# Altium schematic sheet CORE.SchDoc
size A4; SheetNumber: 1; SheetTotal: 6
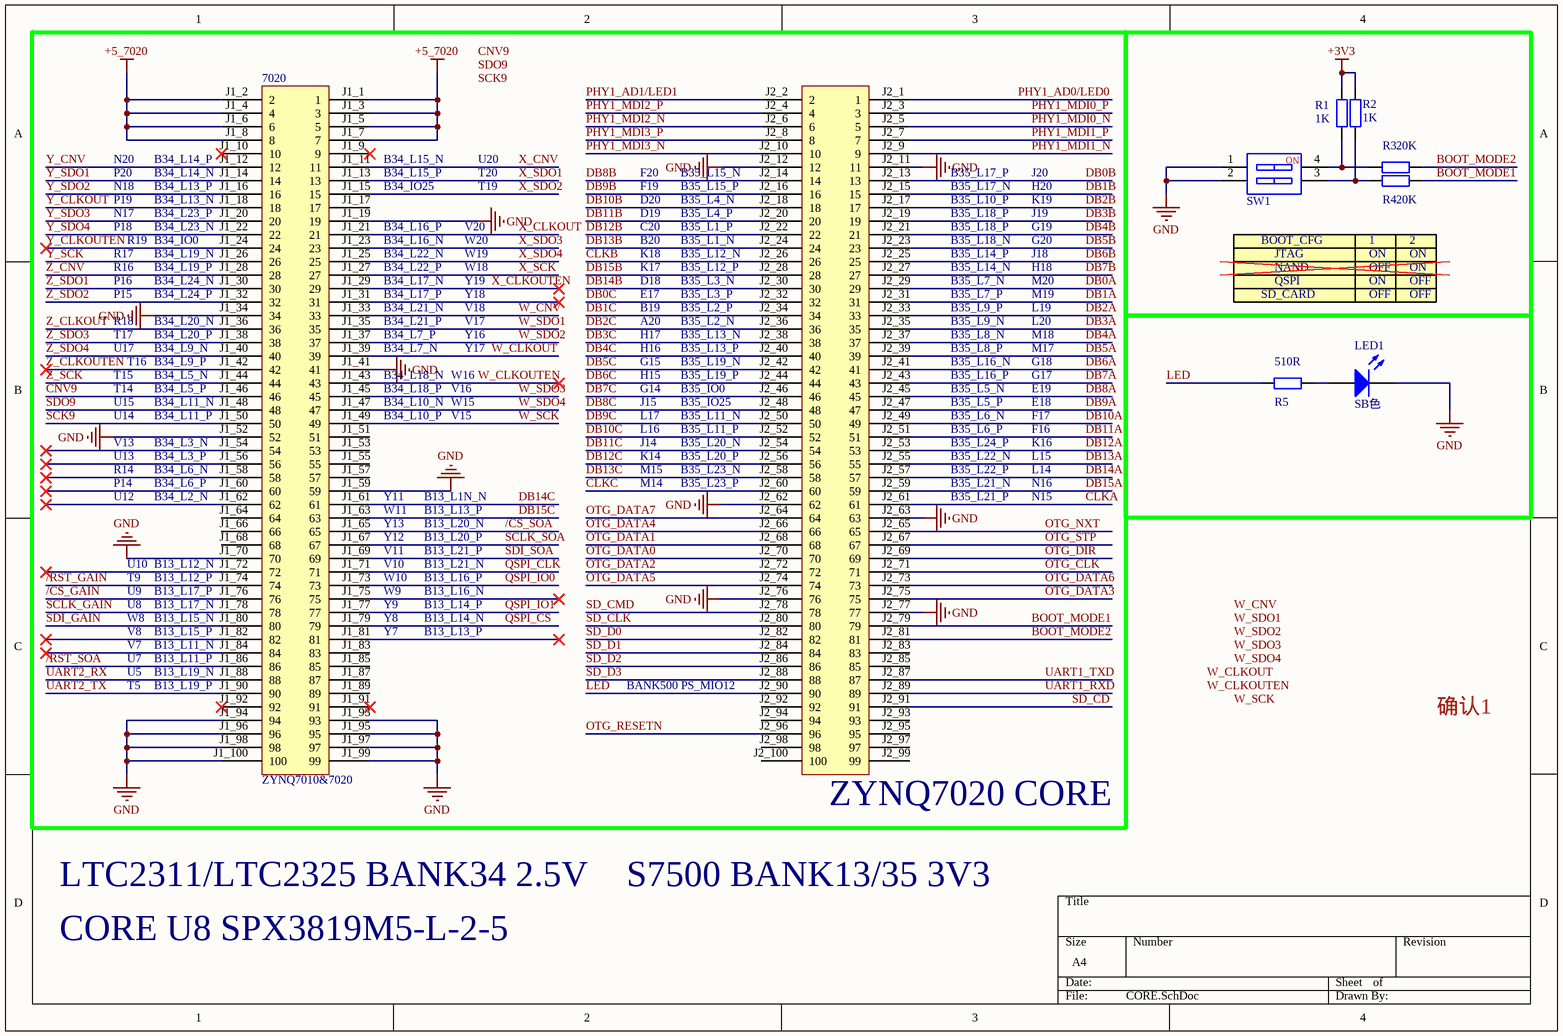
[diagram p0: CORE.SchDoc]

## Parts
7020  ZYNQ7010&7020  [ZYNQ7010&7020_CB]
LED1  SB色  [LED0603_B]
R1  1K  [R0402_L]
R2  1K  [R0402_L]
R3  20K  [R0402_L]
R4  20K  [R0402_L]
R5  510R  [R0603_L]
SW1  DIP-SW-2P  [SW DIP-2P]  (value not drawn)

## Blocks framed on the sheet
ZYNQ7020 CORE: 7020

## Nets
+3V3: R1.2 R2.2
+5_7020: 7020.J1_1(1) 7020.J1_2(2) 7020.J1_3(3) 7020.J1_4(4) 7020.J1_5(5) 7020.J1_6(6) 7020.J1_7(7) 7020.J1_8(8)
GND: 7020.J1_19(19) 7020.J1_34(34) 7020.J1_41(41) 7020.J1_52(52) 7020.J1_59(59) 7020.J1_70(70) 7020.J1_93(93) 7020.J1_94(94) 7020.J1_95(95) 7020.J1_96(96) 7020.J1_97(97) 7020.J1_98(98) 7020.J1_99(99) 7020.J1_100(100) 7020.J2_11(11) 7020.J2_12(12) 7020.J2_62(62) 7020.J2_63(63) 7020.J2_76(76) 7020.J2_77(77) LED1.2(K) SW1.1 SW1.2
/CS_GAIN: 7020.J1_76(76)
/CS_SOA: 7020.J1_65(65)
/RST_GAIN: 7020.J1_74(74)
/RST_SOA: 7020.J1_86(86)
BOOT_MODE1: 7020.J2_79(79) R4.2
BOOT_MODE2: 7020.J2_81(81) R3.2
CLKA: 7020.J2_61(61)
CLKB: 7020.J2_26(26)
CLKC: 7020.J2_60(60)
CNV9: 7020.J1_46(46)
DB0A: 7020.J2_29(29)
DB0B: 7020.J2_13(13)
DB0C: 7020.J2_32(32)
DB1A: 7020.J2_31(31)
DB1B: 7020.J2_15(15)
DB1C: 7020.J2_34(34)
DB2A: 7020.J2_33(33)
DB2B: 7020.J2_17(17)
DB2C: 7020.J2_36(36)
DB3A: 7020.J2_35(35)
DB3B: 7020.J2_19(19)
DB3C: 7020.J2_38(38)
DB4A: 7020.J2_37(37)
DB4B: 7020.J2_21(21)
DB4C: 7020.J2_40(40)
DB5A: 7020.J2_39(39)
DB5B: 7020.J2_23(23)
DB5C: 7020.J2_42(42)
DB6A: 7020.J2_41(41)
DB6B: 7020.J2_25(25)
DB6C: 7020.J2_44(44)
DB7A: 7020.J2_43(43)
DB7B: 7020.J2_27(27)
DB7C: 7020.J2_46(46)
DB8A: 7020.J2_45(45)
DB8B: 7020.J2_14(14)
DB8C: 7020.J2_48(48)
DB9A: 7020.J2_47(47)
DB9B: 7020.J2_16(16)
DB9C: 7020.J2_50(50)
DB10A: 7020.J2_49(49)
DB10B: 7020.J2_18(18)
DB10C: 7020.J2_52(52)
DB11A: 7020.J2_51(51)
DB11B: 7020.J2_20(20)
DB11C: 7020.J2_54(54)
DB12A: 7020.J2_53(53)
DB12B: 7020.J2_22(22)
DB12C: 7020.J2_56(56)
DB13A: 7020.J2_55(55)
DB13B: 7020.J2_24(24)
DB13C: 7020.J2_58(58)
DB14A: 7020.J2_57(57)
DB14B: 7020.J2_30(30)
DB14C: 7020.J1_61(61)
DB15A: 7020.J2_59(59)
DB15B: 7020.J2_28(28)
DB15C: 7020.J1_63(63)
LED: 7020.J2_90(90) R5.1
OTG_CLK: 7020.J2_71(71)
OTG_DATA0: 7020.J2_70(70)
OTG_DATA1: 7020.J2_68(68)
OTG_DATA2: 7020.J2_72(72)
OTG_DATA3: 7020.J2_75(75)
OTG_DATA4: 7020.J2_66(66)
OTG_DATA5: 7020.J2_74(74)
OTG_DATA6: 7020.J2_73(73)
OTG_DATA7: 7020.J2_64(64)
OTG_DIR: 7020.J2_69(69)
OTG_NXT: 7020.J2_65(65)
OTG_RESETN: 7020.J2_96(96)
OTG_STP: 7020.J2_67(67)
PHY1_AD0/LED0: 7020.J2_1(1)
PHY1_AD1/LED1: 7020.J2_2(2)
PHY1_MDI0_N: 7020.J2_5(5)
PHY1_MDI0_P: 7020.J2_3(3)
PHY1_MDI1_N: 7020.J2_9(9)
PHY1_MDI1_P: 7020.J2_7(7)
PHY1_MDI2_N: 7020.J2_6(6)
PHY1_MDI2_P: 7020.J2_4(4)
PHY1_MDI3_N: 7020.J2_10(10)
PHY1_MDI3_P: 7020.J2_8(8)
QSPI_CLK: 7020.J1_71(71)
QSPI_CS: 7020.J1_79(79)
QSPI_IO0: 7020.J1_73(73)
QSPI_IO1: 7020.J1_77(77)
SCK9: 7020.J1_50(50)
SCLK_GAIN: 7020.J1_78(78)
SCLK_SOA: 7020.J1_67(67)
SD_CD: 7020.J2_91(91)
SD_CLK: 7020.J2_80(80)
SD_CMD: 7020.J2_78(78)
SD_D0: 7020.J2_82(82)
SD_D1: 7020.J2_84(84)
SD_D2: 7020.J2_86(86)
SD_D3: 7020.J2_88(88)
SDI_GAIN: 7020.J1_80(80)
SDI_SOA: 7020.J1_69(69)
SDO9: 7020.J1_48(48)
UART1_RXD: 7020.J2_89(89)
UART1_TXD: 7020.J2_87(87)
UART2_RX: 7020.J1_88(88)
UART2_TX: 7020.J1_90(90)
W_CLKOUT: 7020.J1_39(39)
W_CLKOUTEN: 7020.J1_43(43)
W_CNV: 7020.J1_33(33)
W_SCK: 7020.J1_49(49)
W_SDO1: 7020.J1_35(35)
W_SDO2: 7020.J1_37(37)
W_SDO3: 7020.J1_45(45)
W_SDO4: 7020.J1_47(47)
X_CLKOUT: 7020.J1_21(21)
X_CLKOUTEN: 7020.J1_29(29)
X_CNV: 7020.J1_11(11)
X_SCK: 7020.J1_27(27)
X_SDO1: 7020.J1_13(13)
X_SDO2: 7020.J1_15(15)
X_SDO3: 7020.J1_23(23)
X_SDO4: 7020.J1_25(25)
Y_CLKOUT: 7020.J1_18(18)
Y_CLKOUTEN: 7020.J1_24(24)
Y_CNV: 7020.J1_12(12)
Y_SCK: 7020.J1_26(26)
Y_SDO1: 7020.J1_14(14)
Y_SDO2: 7020.J1_16(16)
Y_SDO3: 7020.J1_20(20)
Y_SDO4: 7020.J1_22(22)
Z_CLKOUT: 7020.J1_36(36)
Z_CLKOUTEN: 7020.J1_42(42)
Z_CNV: 7020.J1_28(28)
Z_SCK: 7020.J1_44(44)
Z_SDO1: 7020.J1_30(30)
Z_SDO2: 7020.J1_32(32)
Z_SDO3: 7020.J1_38(38)
Z_SDO4: 7020.J1_40(40)
NetLED1_1: LED1.1(A) R5.2
NetR1_1: R1.1 R3.1 SW1.4
NetR2_1: R2.1 R4.1 SW1.3

Not connected (* = marked no-connect by the designer): 7020 J1_9(9)* J1_10(10)* J1_17(17) J1_31(31)* J1_51(51) J1_53(53) J1_54(54)* J1_55(55) J1_56(56)* J1_57(57) J1_58(58)* J1_60(60)* J1_62(62)* J1_64(64) J1_66(66) J1_68(68) J1_72(72)* J1_75(75)* J1_81(81)* J1_82(82)* J1_83(83) J1_84(84)* J1_85(85) J1_87(87) J1_89(89) J1_91(91)* J1_92(92)* J2_83(83) J2_85(85) J2_92(92) J2_93(93) J2_94(94) J2_95(95) J2_97(97) J2_98(98) J2_99(99) J2_100(100)

## Notes on the sheet
- N20
- P20
- (near 7020) B34_L14_P
- (near 7020) B34_L14_N
- (near 7020) B34_L15_N
- (near 7020) B34_L15_P
- (near 7020) U20
- (near 7020) T20
- (near 7020) F20
- (near 7020) B35_L15_N
- B35_L17_P
- J20
- N18
- P19
- N17
- P18
- R19
- (near 7020) B34_L13_P
- (near 7020) B34_L13_N
- (near 7020) B34_L23_P
- B34_IO0
- (near 7020) B34_L23_N
- (near 7020) B34_IO25
- (near 7020) B34_L16_P
- (near 7020) B34_L16_N
- (near 7020) V20
- (near 7020) W20
- (near 7020) T19
- (near 7020) F19
- (near 7020) D20
- (near 7020) D19
- (near 7020) C20
- (near 7020) B20
- (near 7020) B35_L15_P
- (near 7020) B35_L4_N
- (near 7020) B35_L4_P
- (near 7020) B35_L1_P
- (near 7020) B35_L1_N
- B35_L17_N
- B35_L10_P
- B35_L18_P
- B35_L18_N
- H20
- K19
- J19
- G19
- G20
- BOOT_CFG
- 1
- 2
- R17
- R16
- P16
- P15
- (near 7020) B34_L19_N
- (near 7020) B34_L19_P
- (near 7020) B34_L24_N
- (near 7020) B34_L24_P
- (near 7020) B34_L22_N
- (near 7020) B34_L22_P
- (near 7020) B34_L17_N
- (near 7020) B34_L17_P
- (near 7020) B34_L21_N
- (near 7020) W19
- (near 7020) W18
- (near 7020) Y19
- (near 7020) Y18
- (near 7020) V18
- (near 7020) K18
- (near 7020) K17
- (near 7020) D18
- (near 7020) E17
- (near 7020) B19
- (near 7020) B35_L12_N
- (near 7020) B35_L12_P
- (near 7020) B35_L3_N
- (near 7020) B35_L3_P
- (near 7020) B35_L2_P
- B35_L7_N
- B35_L7_P
- B35_L9_P
- B35_L14_P
- B35_L14_N
- M20
- M19
- L19
- J18
- H18
- SD_CARD
- JTAG
- NAND
- QSPI
- ON
- OFF
- R18
- T17
- U17
- T15
- T16
- (near 7020) B34_L20_N
- (near 7020) B34_L20_P
- B34_L9_N
- B34_L9_P
- B34_L5_N
- (near 7020) B34_L21_P
- (near 7020) B34_L7_P
- (near 7020) B34_L7_N
- (near 7020) B34_L18_N
- (near 7020) W16
- (near 7020) V17
- (near 7020) Y16
- (near 7020) Y17
- (near 7020) A20
- (near 7020) H17
- (near 7020) H16
- (near 7020) G15
- (near 7020) H15
- (near 7020) B35_L2_N
- (near 7020) B35_L13_N
- (near 7020) B35_L13_P
- (near 7020) B35_L19_N
- (near 7020) B35_L19_P
- B35_L9_N
- B35_L8_N
- B35_L8_P
- B35_L16_N
- B35_L16_P
- L20
- M18
- M17
- G18
- G17
- T14
- U15
- U14
- V13
- B34_L5_P
- (near 7020) B34_L11_N
- (near 7020) B34_L11_P
- B34_L3_N
- (near 7020) B34_L18_P
- (near 7020) B34_L10_N
- (near 7020) B34_L10_P
- (near 7020) V16
- (near 7020) W15
- (near 7020) V15
- (near 7020) G14
- (near 7020) J15
- (near 7020) L17
- (near 7020) L16
- (near 7020) J14
- (near 7020) B35_IO0
- (near 7020) B35_IO25
- (near 7020) B35_L11_N
- (near 7020) B35_L11_P
- (near 7020) B35_L20_N
- B35_L5_N
- B35_L5_P
- B35_L6_N
- B35_L6_P
- B35_L24_P
- E19
- E18
- F17
- F16
- K16
- U13
- R14
- P14
- U12
- B34_L3_P
- B34_L6_N
- B34_L6_P
- B34_L2_N
- (near 7020) Y11
- (near 7020) W11
- (near 7020) B13_L1N_N
- (near 7020) B13_L13_P
- (near 7020) K14
- (near 7020) M15
- (near 7020) M14
- (near 7020) B35_L20_P
- (near 7020) B35_L23_N
- (near 7020) B35_L23_P
- B35_L22_N
- B35_L22_P
- B35_L21_N
- B35_L21_P
- L15
- L14
- N16
- N15
- U10
- T9
- (near 7020) B13_L12_N
- (near 7020) B13_L12_P
- (near 7020) Y13
- (near 7020) Y12
- (near 7020) V11
- (near 7020) V10
- (near 7020) W10
- (near 7020) B13_L20_N
- (near 7020) B13_L20_P
- (near 7020) B13_L21_P
- (near 7020) B13_L21_N
- (near 7020) B13_L16_P
- U9
- U8
- W8
- V8
- V7
- (near 7020) B13_L17_P
- (near 7020) B13_L17_N
- (near 7020) B13_L15_N
- (near 7020) B13_L15_P
- (near 7020) B13_L11_N
- (near 7020) W9
- (near 7020) Y9
- (near 7020) Y8
- (near 7020) Y7
- (near 7020) B13_L16_N
- (near 7020) B13_L14_P
- (near 7020) B13_L14_N
- U7
- T5
- U5
- (near 7020) B13_L11_P
- (near 7020) B13_L19_N
- (near 7020) B13_L19_P
- (near 7020) BANK500 PS_MIO12
- 确认1
- LTC2311/LTC2325 BANK34 2.5V
- S7500 BANK13/35 3V3
- CORE U8 SPX3819M5-L-2-5
- Labels drawn without touching a wire or pin: CNV9, SCK9, SDO9, W_CLKOUT, W_CLKOUTEN, W_CNV, W_SCK, W_SDO1, W_SDO2, W_SDO3, W_SDO4
- (in symbol DIP-SW-2P) NO

## Library data of the parts
7020 = ZYNQ7010&7020: ZYNQ7010&7020 Core Board
LED1 = LED: 贴片LED; 封装库来自淘宝卖家：黄晶宝石: 其他店铺购入均为盗版封装库，无更新权益，请立即申请退款，本店现金奖励200~1000元; BOM名称: 贴片LED
R1-R5 = R: 贴片电阻; 联系下单店铺卖家 免费帮你查找封装: 联系下单店铺卖家 免费技术支持; BOM名称: 贴片电阻
SW1 = DIP-SW-2P: 2路拨码开关; 联系下单店铺卖家 免费技术支持: 联系下单店铺卖家 免费帮你查找封装; BOM名称: 2路拨码开关